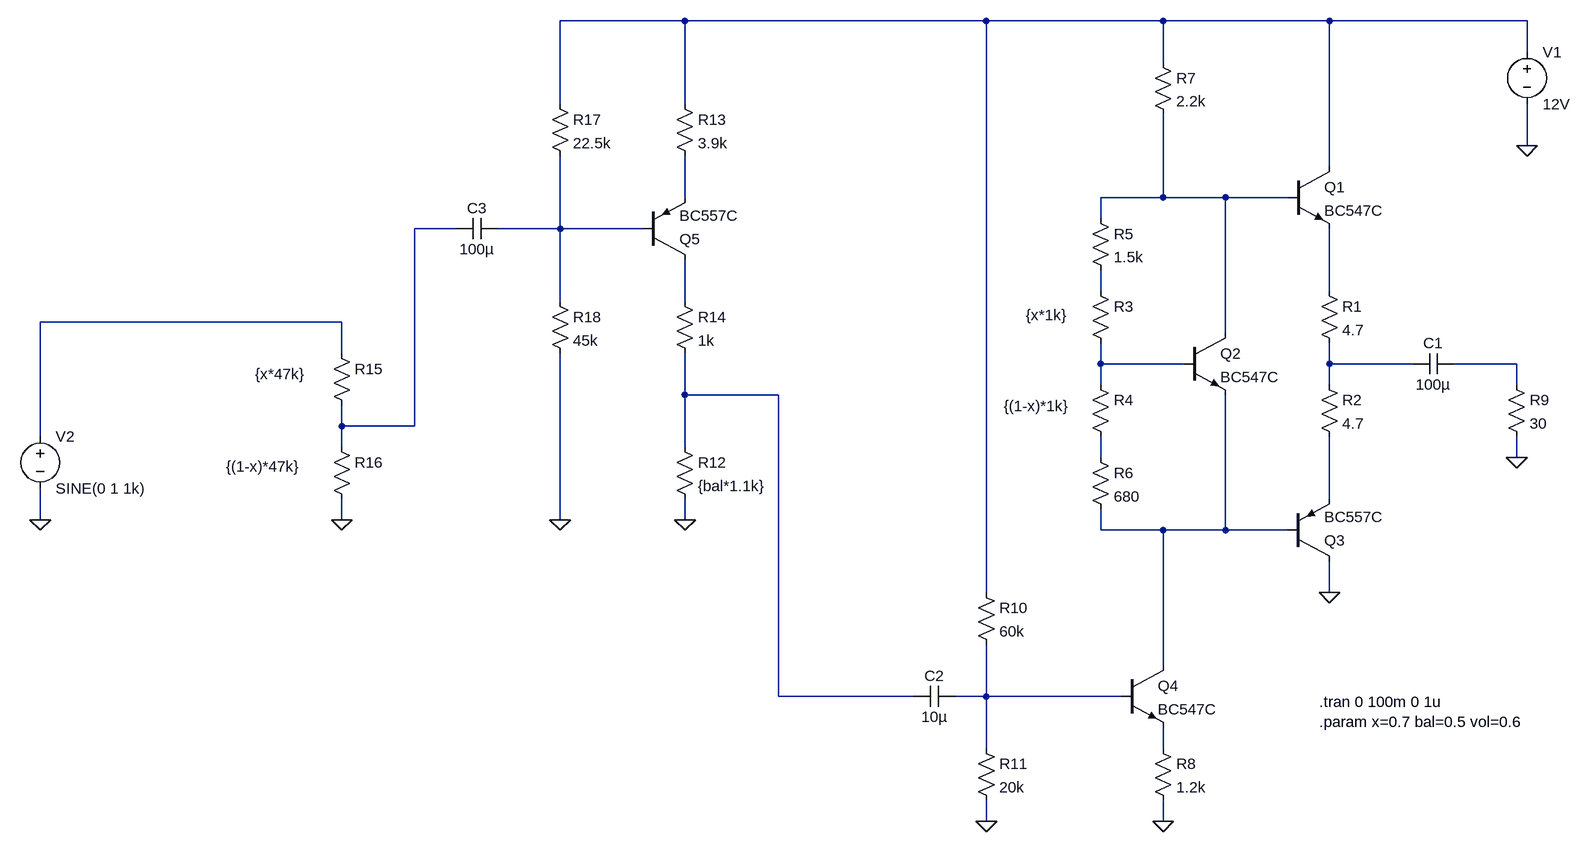
[diagram p0: schematic core.asc]
core.asc, the LTspice schematic file:
Version 4
SHEET 1 880 1316
WIRE -800 -208 -992 -208
WIRE -336 -208 -800 -208
WIRE -64 -208 -336 -208
WIRE 192 -208 -64 -208
WIRE 496 -208 192 -208
WIRE 496 -160 496 -208
WIRE -64 -144 -64 -208
WIRE -992 -80 -992 -208
WIRE -800 -80 -800 -208
WIRE 496 -16 496 -80
WIRE 192 16 192 -208
WIRE -800 64 -800 0
WIRE -64 64 -64 -64
WIRE -64 64 -160 64
WIRE 32 64 -64 64
WIRE 128 64 32 64
WIRE -160 96 -160 64
WIRE -1152 112 -1216 112
WIRE -992 112 -992 0
WIRE -992 112 -1088 112
WIRE -864 112 -992 112
WIRE -160 208 -160 176
WIRE 192 208 192 112
WIRE -992 224 -992 112
WIRE -800 224 -800 160
WIRE -1328 256 -1792 256
WIRE 32 272 32 64
WIRE -1328 304 -1328 256
WIRE -160 320 -160 288
WIRE -32 320 -160 320
WIRE 192 320 192 288
WIRE 320 320 192 320
WIRE 480 320 384 320
WIRE -160 352 -160 320
WIRE 192 352 192 320
WIRE 480 352 480 320
WIRE -800 368 -800 304
WIRE -656 368 -800 368
WIRE -1328 416 -1328 384
WIRE -1216 416 -1216 112
WIRE -1216 416 -1328 416
WIRE -1792 432 -1792 256
WIRE -1328 448 -1328 416
WIRE -800 448 -800 368
WIRE -160 464 -160 432
WIRE 480 464 480 432
WIRE 192 528 192 432
WIRE -1792 560 -1792 512
WIRE -1328 560 -1328 528
WIRE -992 560 -992 304
WIRE -800 560 -800 528
WIRE -160 576 -160 544
WIRE -64 576 -160 576
WIRE 32 576 32 368
WIRE 32 576 -64 576
WIRE 128 576 32 576
WIRE -336 672 -336 -208
WIRE 192 672 192 624
WIRE -64 784 -64 576
WIRE -656 832 -656 368
WIRE -448 832 -656 832
WIRE -336 832 -336 752
WIRE -336 832 -384 832
WIRE -128 832 -336 832
WIRE -336 912 -336 832
WIRE -64 912 -64 880
WIRE -336 1024 -336 992
WIRE -64 1024 -64 992
FLAG 192 672 0
FLAG 496 -16 0
FLAG -64 1024 0
FLAG 480 464 0
FLAG -336 1024 0
FLAG -1792 560 0
FLAG -800 560 0
FLAG -1328 560 0
FLAG -992 560 0
SYMBOL npn2 128 16 R0
SYMATTR InstName Q1
SYMATTR Value BC547C
SYMBOL npn2 -32 272 R0
SYMATTR InstName Q2
SYMATTR Value BC547C
SYMBOL res 176 192 R0
SYMATTR InstName R1
SYMATTR Value 4.7
SYMBOL res 176 336 R0
SYMATTR InstName R2
SYMATTR Value 4.7
SYMBOL pnp2 128 624 M180
SYMATTR InstName Q3
SYMATTR Value BC557C
SYMBOL res -176 192 R0
WINDOW 3 -99 53 Left 2
SYMATTR Value {x*1k}
SYMATTR InstName R3
SYMBOL res -176 336 R0
WINDOW 3 -133 49 Left 2
SYMATTR Value {(1-x)*1k}
SYMATTR InstName R4
SYMBOL res -176 80 R0
SYMATTR InstName R5
SYMATTR Value 1.5k
SYMBOL res -176 448 R0
SYMATTR InstName R6
SYMATTR Value 680
SYMBOL res -80 -160 R0
SYMATTR InstName R7
SYMATTR Value 2.2k
SYMBOL voltage 496 -176 R0
WINDOW 123 0 0 Left 0
WINDOW 39 0 0 Left 0
SYMATTR InstName V1
SYMATTR Value 12V
SYMBOL npn2 -128 784 R0
SYMATTR InstName Q4
SYMATTR Value BC547C
SYMBOL res -80 896 R0
SYMATTR InstName R8
SYMATTR Value 1.2k
SYMBOL cap 384 304 R90
WINDOW 0 0 32 VBottom 2
WINDOW 3 32 32 VTop 2
SYMATTR InstName C1
SYMATTR Value 100µ
SYMBOL res 464 336 R0
SYMATTR InstName R9
SYMATTR Value 30
SYMBOL res -352 656 R0
SYMATTR InstName R10
SYMATTR Value 60k
SYMBOL res -352 896 R0
SYMATTR InstName R11
SYMATTR Value 20k
SYMBOL cap -384 816 R90
WINDOW 0 0 32 VBottom 2
WINDOW 3 32 32 VTop 2
SYMATTR InstName C2
SYMATTR Value 10µ
SYMBOL voltage -1792 416 R0
WINDOW 123 0 0 Left 0
WINDOW 39 0 0 Left 0
SYMATTR InstName V2
SYMATTR Value SINE(0 1 1k)
SYMBOL pnp2 -864 160 M180
SYMATTR InstName Q5
SYMATTR Value BC557C
SYMBOL res -816 432 R0
SYMATTR InstName R12
SYMATTR Value {bal*1.1k}
SYMBOL res -816 -96 R0
SYMATTR InstName R13
SYMATTR Value 3.9k
SYMBOL res -816 208 R0
SYMATTR InstName R14
SYMATTR Value 1k
SYMBOL res -1344 288 R0
WINDOW 3 -117 48 Left 2
SYMATTR Value {x*47k}
SYMATTR InstName R15
SYMBOL res -1344 432 R0
WINDOW 3 -162 46 Left 2
SYMATTR Value {(1-x)*47k}
SYMATTR InstName R16
SYMBOL cap -1088 96 R90
WINDOW 0 0 32 VBottom 2
WINDOW 3 32 32 VTop 2
SYMATTR InstName C3
SYMATTR Value 100µ
SYMBOL res -1008 -96 R0
SYMATTR InstName R17
SYMATTR Value 22.5k
SYMBOL res -1008 208 R0
SYMATTR InstName R18
SYMATTR Value 45k
TEXT 176 840 Left 2 !.tran 0 100m 0 1u\n.param x=0.7 bal=0.5 vol=0.6

The netlist it stands for:
* core.asc
Q1 N001 N003 N007 0 BC547C
Q2 N003 N010 N016 0 BC547C
R1 N007 N011 4.7
R2 N011 N015 4.7
Q3 0 N016 N015 0 BC557C
R3 N006 N010 {x*1k}
R4 N010 N014 {(1-x)*1k}
R5 N003 N006 1.5k
R6 N014 N016 680
R7 N001 N003 2.2k
V1 N001 0 12V
Q4 N016 N017 N018 0 BC547C
R8 N018 0 1.2k
C1 N012 N011 100µ
R9 N012 0 30
R10 N001 N017 60k
R11 N017 0 20k
C2 N017 N013 10µ
V2 N009 0 SINE(0 1 1k)
Q5 N008 N005 N002 0 BC557C
R12 N013 0 {bal*1.1k}
R13 N001 N002 3.9k
R14 N008 N013 1k
R15 N009 N004 {x*47k}
R16 N004 0 {(1-x)*47k}
C3 N005 N004 100µ
R17 N001 N005 22.5k
R18 N005 0 45k
.model NPN NPN
.model PNP PNP
.lib standard.bjt
.tran 0 100m 0 1u
.param x=0.7 bal=0.5 vol=0.6
.backanno
.end